# Altium project Acoustics Single Channel.PrjPcb
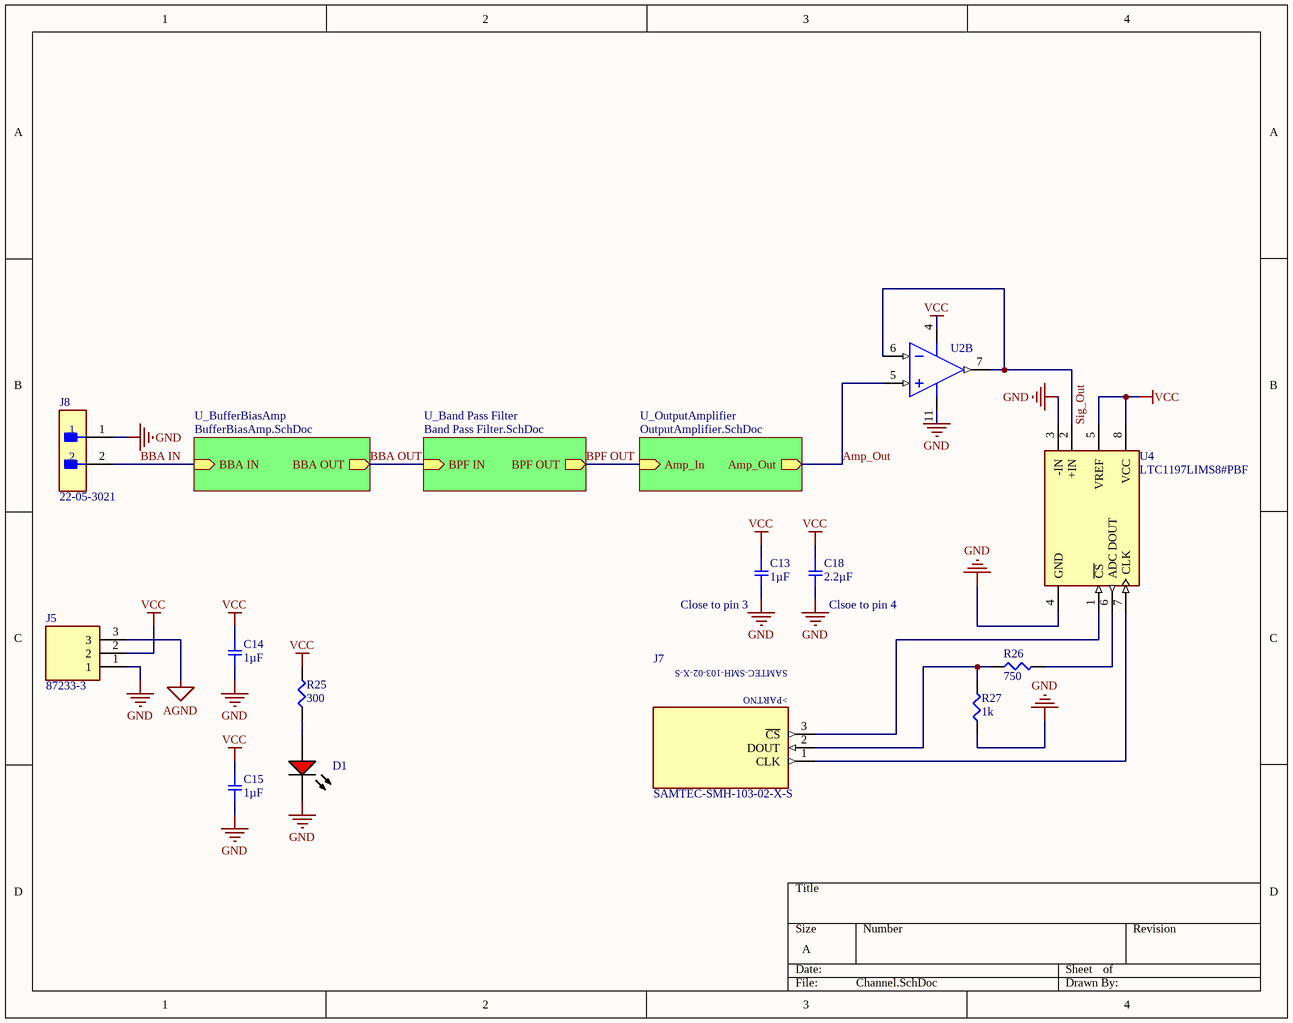
[diagram p0: Channel.SchDoc]
4 sheets, 53 parts. Net scope: hierarchical (ports join the sheet entries above them; power ports are global).
Board file: AcousticsSingleChannel.PcbDoc
Sheets:
  Channel.SchDoc
    U_OutputAmplifier = OutputAmplifier.SchDoc
    U_Band Pass Filter = Band Pass Filter.SchDoc
    U_BufferBiasAmp = BufferBiasAmp.SchDoc

## Sheet Channel.SchDoc
size A; SheetNumber: 1; SheetTotal: 4

### Parts
C13  1µF  [SMD-0603C]
C14  1µF  [SMD-0603C]
C15  1µF  [SMD-0603C]
C18  2.2µF  [SMD-0603C]
D1  TLMS1100-GS08  [VISH-TLMX1100_V]  (value not drawn)
J5  87233-3  [TE_87233-3]
J7  SAMTEC-SMH-103-02-X-S  [SAMTEC-SMH-103-02-X-S]
J8  22-05-3021  [FP-22-05-3021-MFG]
R25  300  [SMD-0603-RES]
R26  750  [SMD-0603-RES]
R27  1k  [SMD-0603-RES]
U2  OPA1604AIPWR  [PW0014A_N]  (value not drawn)  (part B of 4)
U4  LTC1197LIMS8#PBF  [FP-MS8-8-05-08-1660-IPC_A]

### Sub-sheets
U_Band Pass Filter = Band Pass Filter.SchDoc: BPF IN (in), BPF OUT (out)
U_BufferBiasAmp = BufferBiasAmp.SchDoc: BBA IN (in), BBA OUT (out)
U_OutputAmplifier = OutputAmplifier.SchDoc: Amp_In (in), Amp_Out (out)

### Nets
AGND: J5.3
GND: C13.2 C14.1 C15.1 C18.2 D1.2(K) J5.1 J8.1 R27.1 U2.11(V-) U4.3(-IN) U4.4(GND)
VCC: C13.1 C14.2 C15.2 C18.1 J5.2 R25.2 U2.4(V+) U4.5(VREF) U4.8(VCC)
Amp_Out: U2.5(IN_B+) ; sheet U_OutputAmplifier/Amp_Out
BBA IN: J8.2 ; sheet U_BufferBiasAmp/BBA IN
BBA OUT: sheet U_Band Pass Filter/BPF IN, sheet U_BufferBiasAmp/BBA OUT
BPF OUT: sheet U_OutputAmplifier/Amp_In, sheet U_Band Pass Filter/BPF OUT
Sig_Out: U2.6(IN_B-) U2.7(OUT_B) U4.2(+IN)
NetD1_1: D1.1(A) R25.1
NetJ7_1: J7.1(CLK) U4.7(CLK)
NetJ7_2: J7.2(DOUT) R26.1 R27.2
NetJ7_3: J7.3(~{CS}) U4.1(~{CS})
NetR26_2: R26.2 U4.6(ADC_DOUT)

### Notes on the sheet
- (near C13) Close to pin 3
- (near C18) Clsoe to pin 4
- (in symbol SAMTEC-SMH-103-02-X-S) >PARTNO

### Library data of the parts
C13 = GRM185C80J105KE26D: CAP CER 1UF 6.3V X6S 0603; Manufacturer: Murata Electronics North America; Factory Stock: 0; Unit Price (USD): 0.2; Minimum Quantity: 1; Tolerance: ±10%; Datasheets: http://www.murata.com/~/media/webrenewal/support/library/catalog/products/capacitor/mlcc/c02e.pdf; Image: //media.digikey.com/Renders/Murata%20Renders/ZRB-SERIES-0402.jpg; Digi-Key Part Number: 490-8271-1-ND; Part Number: GRM185C80J105KE26D; Quantity Available: 11240; @ qty: 0; Packaging: Cut Tape (CT); Series: GRM; Part Status: Active; Value: 1µF; Voltage: 6.3V; Temperature Coefficient: X6S; Operating Temperature: -55°C ~ 105°C; Features: -; Ratings: -; Applications: General Purpose; Mounting Type: Surface Mount, MLCC; Package / Case: 0603 (1608 Metric); Size / Dimension: 0.063" L x 0.031" W (1.60mm x 0.80mm); Height - Seated (Max): -; Thickness (Max): 0.020" (0.50mm); Lead Spacing: -; Lead Style: -
C14 C15 = GCM188R71C105KA64D: CAP CER 1UF 16V X7R 0603; Manufacturer: Samsung Electro-Mechanics; Manufacturer Part Number: CL10A105KA8NNNC; Value: 1µF; Operating Temperature: -55°C ~ 125°C; Package / Case: 0603 (1608 Metric); Datasheet Link: https://www.digikey.com/en/products/detail/samsung-electro-mechanics/CL10A105KA8NNNC/3886760
C18 = GCM188R70J225KE22D: CAP CER 2.2UF 6.3V X7R 0603; Manufacturer: Murata Electronics North America; Factory Stock: 0; Unit Price (USD): 0.23; Minimum Quantity: 1; Tolerance: ±10%; Datasheets: http://www.murata.com/~/media/webrenewal/support/library/catalog/products/capacitor/mlcc/c03e.ashx; Image: //media.digikey.com/Renders/Murata%20Renders/0603%28GCM188%29.jpg; Digi-Key Part Number: 490-5316-1-ND; Part Number: GCM188R70J225KE22D; Quantity Available: 20695; @ qty: 0; Packaging: Cut Tape (CT); Series: GCM; Part Status: Active; Value: 2.2µF; Voltage: 6.3V; Temperature Coefficient: X7R; Operating Temperature: -55°C ~ 125°C; Features: -; Ratings: AEC-Q200; Applications: Automotive; Mounting Type: Surface Mount, MLCC; Package / Case: 0603 (1608 Metric); Size / Dimension: 0.063" L x 0.031" W (1.60mm x 0.80mm); Height - Seated (Max): -; Thickness (Max): 0.035" (0.90mm); Lead Spacing: -; Lead Style: -
D1 = CMP-1666-00027-1: LED, RED, 2.1 V, -40 to 100 degC, 2-Pin SMD (0603), RoHS, Tape and Reel; Manufacturer: Wurth Elektronics; Manufacturer Part Number: 150080SS75000; Value: 1.9V; Datasheet Link: https://www.mouser.com/ProductDetail/Wurth-Elektronik/150080SS75000?qs=LlUlMxKIyB2zzpiaOzrUdw%3D%3D&mgh=1&gclid=Cj0KCQjwm6KUBhC3ARIsACIwxBhChbj4MsdASq_HKZ9IIHp_SBsI6cWeNQVHWnPWPX4ZaUjtoXFUdFUaAm30EALw_wcB; Operating Temperature: -40to85degC; Package / Case: 0805 (2012 Metric); RoHS: Pb-Free
J5 = 87233-3: MF: {'manufacturer': u'TE Connectivity'}; Value: *; Price: None; Package: None; Availability: Unavailable; MP: 87233-3
J7 = SAMTEC-SMH-103-02-X-S: MF: {'manufacturer': u'Samtec'}; Value: *; Package: None; MP: SAMTEC-SMH-103-02-X-S; Availability: Unavailable; Price: None
J8 = CMP-04776-000166-1: CONN HEADER R/A 2POS 2.54MM; Glow Wire Compliant: Non-compliant; Max Current Rating: 4A; Number of Positions: 2; Contact Resistance: 10mR; Max Voltage Rating (AC): 250V; Gender: Male; Approvals: UL; Contact Material: Brass; Halogen Free: Low Halogen; Depth: 12.83mm; Color: White; Mount: Through Hole; Housing Color: White; Package Quantity: 3000; Series: KK® 7478; Packaging: Bulk; Length: 5.08mm; Fastening Type: Friction; Contact Plating: Tin; Flammability Rating: UL94 V-0; Housing Material: Nylon; Current Rating: 4A; Max Operating Temperature: 75°C; Height: 6.35mm; Lead Free: Lead Free; Pitch: 2.54mm; Termination: Solder; Min Operating Temperature: 0°C; Voltage Rating: 250V; Radiation Hardening: No; Number of Contacts: 2; Contact Mating Length: 0.264inch; Orientation: Right Angle; Contact Type: Male Pin; Number of Rows: 1; Number of Circuits: 2
R25 = ERJ-3EKF3000V: RES SMD 300 OHM 1% 1/10W 0603; Manufacturer: Panasonic Electronic Components; Value: 300; Operating Temperature: -55°C ~ 155°C; Package / Case: 0603 (1608 Metric); Datasheet Link: https://www.digikey.com/en/products/detail/panasonic-electronic-components/ERJ-3EKF3000V/1746363; Manufacturer Part Number: ERJ-3EKF3000V
R26 = ERJ-3EKF7500V: RES SMD 750 OHM 1% 1/10W 0603; Manufacturer: Panasonic Electronic Components; Factory Stock: 0; Unit Price (USD): 0.00379; @ qty: 1500; Minimum Quantity: 1; Power (Watts): 0.1W, 1/10W; Temperature Coefficient: ±100ppm/°C; Part Number: ERJ-3EKF7500V; Datasheets: http://industrial.panasonic.com/www-cgi/jvcr13pz.cgi?E+PZ+3+AOA0002+ERJ3EKF7500V+7+WW; Image: //media.digikey.com/Photos/Panasonic%20Photos/MFG_ERJ-P6W%20Series.jpg; Digi-Key Part Number: P750HCT-ND; Quantity Available: 102837; Packaging: Cut Tape (CT); Series: ERJ; Part Status: Active; Value: 750; Tolerance: ±1%; Composition: Thick Film; Features: Automotive AEC-Q200; Operating Temperature: -55°C ~ 155°C; Package / Case: 0603 (1608 Metric); Supplier Device Package: 0603; Size / Dimension: 0.063" L x 0.031" W (1.60mm x 0.80mm); Height - Seated (Max): 0.022" (0.55mm); Number of Terminations: 2; Failure Rate: -
R27 = ERJ-3EKF1001V: RES SMD 1K OHM 1% 1/10W 0603; Manufacturer: Panasonic Electronic Components; Factory Stock: 0; Unit Price (USD): 0.00379; @ qty: 1500; Minimum Quantity: 1; Power (Watts): 0.1W, 1/10W; Temperature Coefficient: ±100ppm/°C; Part Number: ERJ-3EKF1001V; Datasheets: http://industrial.panasonic.com/www-cgi/jvcr13pz.cgi?E+PZ+3+AOA0002+ERJ3EKF1001V+7+WW; Image: //media.digikey.com/Photos/Panasonic%20Photos/MFG_ERJ-P6W%20Series.jpg; Digi-Key Part Number: P1.00KHCT-ND; Quantity Available: 5218845; Packaging: Cut Tape (CT); Series: ERJ; Part Status: Active; Value: 1k; Tolerance: ±1%; Composition: Thick Film; Features: Automotive AEC-Q200; Operating Temperature: -55°C ~ 155°C; Package / Case: 0603 (1608 Metric); Supplier Device Package: 0603; Size / Dimension: 0.063" L x 0.031" W (1.60mm x 0.80mm); Height - Seated (Max): 0.022" (0.55mm); Number of Terminations: 2; Failure Rate: -
U2 = CMP-0272-01731-3: Sound Plus High-Performance, Bipolar-Input Audio Operational Amplifier, 4.5 to 36 V, -40 to 85 degC, 14-pin SOP (PW14), Green (RoHS & no Sb/Br); Manufacturer: Texas Instruments; Datasheet Link: https://www.digikey.com/en/products/detail/texas-instruments/OPA1604AIPWR/2793768; Manufacturer Part Number: OPA1604AIPWR; Operating Temperature: -40°C ~ 85°C; Package / Case: 14-TSSOP
U4 = CMP-09081-000582-1: IC ADC 10BIT SAR 8MSOP; Number of Converters: 1; Polarity: Unipolar; Max Supply Voltage: 4V; Number of Bits: 10; Max Power Dissipation: 25mW; Min Supply Voltage: 2.7V; Sampling Rate: 250000S/s; Integral Nonlinearity (INL): 1LSB; Supply Type: Single; Resolution: 10b; Power Dissipation: 500mW; Interface: SPI; Operating Supply Voltage: 3V; Package Quantity: 50; Min Operating Temperature: -40°C; Case/Package: MSOP; Lead Free: Lead Free; Max Operating Temperature: 85°C; Number of Elements: 1; RoHS Compliant: Yes; Mount: Surface Mount; Number of Pins: 8; Packaging: Rail/Tube

## Sheet OutputAmplifier.SchDoc
size A; SheetNumber: 4; SheetTotal: 4
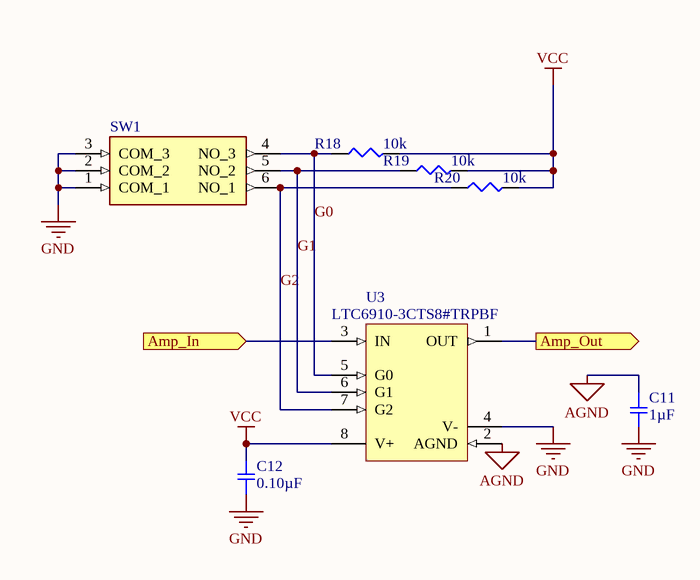
[diagram p1: OutputAmplifier.SchDoc]

### Parts
C11  1µF  [SMD-0603C]
C12  0.10µF  [SMD-0603C]
R18  10k  [SMD-0603-RES]
R19  10k  [SMD-0603-RES]
R20  10k  [SMD-0603-RES]
SW1  416131160803  [416131160803]  (value not drawn)
U3  LTC6910-3CTS8#TRPBF  [LT-TS8-8-TSOT-23_V]

### Ports
Amp_In (in), Amp_Out (out)

### Nets
AGND: C11.1 U3.2(AGND)
GND: C11.2 C12.1 SW1.1(COM_1) SW1.2(COM_2) SW1.3(COM_3) U3.4(V-)
VCC: C12.2 R18.2 R19.2 R20.2 U3.8(V+)
Amp_Out: U3.1(OUT) ; port Amp_Out
BPF OUT: U3.3(IN) ; port Amp_In
G0: R18.1 SW1.4(NO_3) U3.5(G0)
G1: R19.1 SW1.5(NO_2) U3.6(G1)
G2: R20.1 SW1.6(NO_1) U3.7(G2)

### Library data of the parts
C11 = GCM188R71C105KA64D: CAP CER 1UF 16V X7R 0603; Manufacturer: Murata Electronics North America; Factory Stock: 0; Unit Price (USD): 0.24; Minimum Quantity: 1; Tolerance: ±10%; Datasheets: http://www.murata.com/~/media/webrenewal/support/library/catalog/products/capacitor/mlcc/c03e.ashx; Image: //media.digikey.com/Renders/Murata%20Renders/0603%28GCM188%29.jpg; Digi-Key Part Number: 490-5241-1-ND; Part Number: GCM188R71C105KA64D; Quantity Available: 9243; @ qty: 0; Packaging: Cut Tape (CT); Series: GCM; Part Status: Active; Value: 1µF; Voltage: 16V; Temperature Coefficient: X7R; Operating Temperature: -55°C ~ 125°C; Features: -; Ratings: AEC-Q200; Applications: Automotive; Mounting Type: Surface Mount, MLCC; Package / Case: 0603 (1608 Metric); Size / Dimension: 0.063" L x 0.031" W (1.60mm x 0.80mm); Height - Seated (Max): -; Thickness (Max): 0.035" (0.90mm); Lead Spacing: -; Lead Style: -
C12 = GCJ188R71C104KA01D: CAP CER 0.1UF 16V X7R 0603; Manufacturer: Murata Electronics North America; Factory Stock: 0; Unit Price (USD): 0.21; Minimum Quantity: 1; Tolerance: ±10%; Datasheets: http://www.murata.com/~/media/webrenewal/support/library/catalog/products/capacitor/mlcc/c03e.ashx; Image: //media.digikey.com/Renders/Murata%20Renders/0603%28LQG18%29.jpg; Digi-Key Part Number: 490-5796-1-ND; Part Number: GCJ188R71C104KA01D; Quantity Available: 22473; @ qty: 0; Packaging: Cut Tape (CT); Series: GCJ; Part Status: Active; Value: 0.10µF; Voltage: 16V; Temperature Coefficient: X7R; Operating Temperature: -55°C ~ 125°C; Features: Soft Termination; Ratings: AEC-Q200; Applications: Automotive, Boardflex Sensitive; Mounting Type: Surface Mount, MLCC; Package / Case: 0603 (1608 Metric); Size / Dimension: 0.063" L x 0.031" W (1.60mm x 0.80mm); Height - Seated (Max): -; Thickness (Max): 0.035" (0.90mm); Lead Spacing: -; Lead Style: -
R18-R20 = ERJ-3EKF1002V: RES SMD 10K OHM 1% 1/10W 0603; Manufacturer: Panasonic Electronic Components; Manufacturer Part Number: RNCP0603FTD10K0; Value: 10k; Operating Temperature: -55°C ~ 155°C; Package / Case: 0603 (1608 Metric); Datasheet Link: https://www.digikey.com/en/products/detail/stackpole-electronics-inc/RNCP0603FTD10K0/2240139
SW1 = 416131160803: Switch; Manufacturer_Name: Wurth Elektronik; Datasheet Link: https://www.we-online.com/catalog/datasheet/416131160803.pdf; Height: 2.65mm; Manufacturer_Part_Number: 416131160803; Mouser Part Number: 710-416131160803; Mouser Price/Stock: https://www.mouser.co.uk/ProductDetail/Wurth-Elektronik/416131160803?qs=2kOmHSv6VfS5Uv9iBh18ZA%3D%3D
U3 = CMP-0359-03721-2: Manufacturer: Analog Devices Inc.; Manufacturer Part Number: LTC6910-3CTS8#TRMPBF; RoHS: Pb-Free; Value: N/A; Operating Temperature: 0°C ~ 70°C; Datasheet Link: https://www.analog.com/media/en/technical-documentation/data-sheets/6910fb.pdf; Package / Case: TSOT-23-8

## Sheet Band Pass Filter.SchDoc
size 431 x 279 mm; Organization: ORGANIZATION; Address1: ADDRESS 1; Address2: ADDRESS 2; Address3: ADDRESS 3; Address4: ADDRESS 4; Revision: -; SheetNumber: 2; SheetTotal: 4; ENG_APP_DATE: --/--/--; DSN_APP_DATE: --/--/--; CHK_APP_DATE: --/--/--
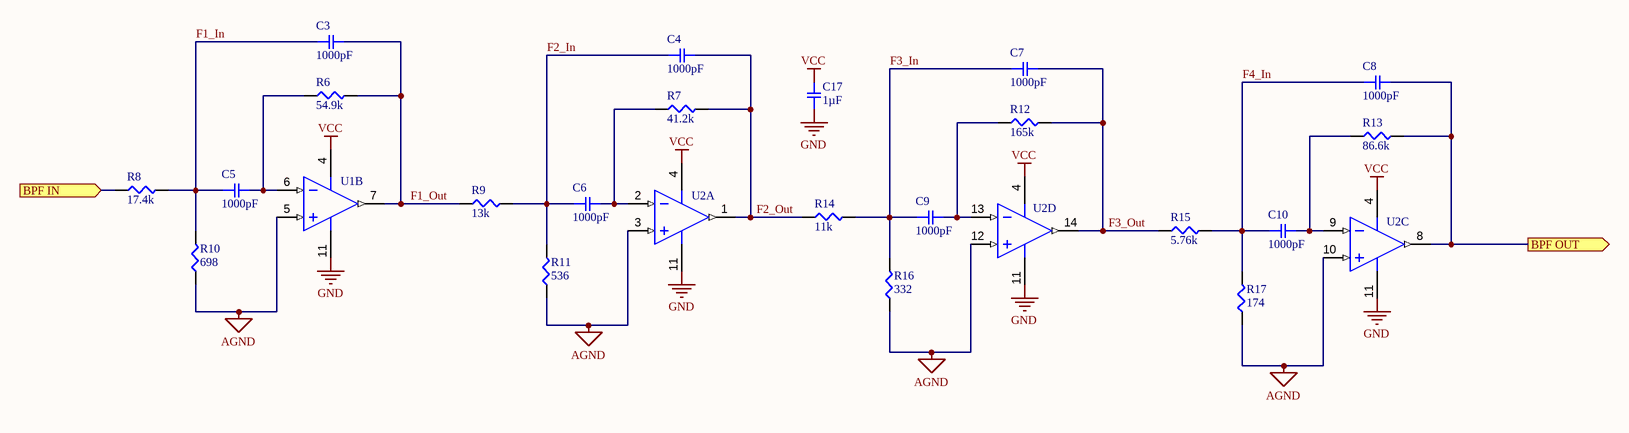
[diagram p2: Band Pass Filter.SchDoc]

### Parts
C3  1000pF  [SMD-0603C]
C4  1000pF  [SMD-0603C]
C5  1000pF  [SMD-0603C]
C6  1000pF  [SMD-0603C]
C7  1000pF  [SMD-0603C]
C8  1000pF  [SMD-0603C]
C9  1000pF  [SMD-0603C]
C10  1000pF  [SMD-0603C]
C17  1µF  [SMD-0603C]
R6  54.9k  [SMD-0603-RES]
R7  41.2k  [SMD-0603-RES]
R8  17.4k  [SMD-0603-RES]
R9  13k  [SMD-0603-RES]
R10  698  [SMD-0603-RES]
R11  536  [SMD-0603-RES]
R12  165k  [SMD-0603-RES]
R13  86.6k  [SMD-0603-RES]
R14  11k  [SMD-0603-RES]
R15  5.76k  [SMD-0603-RES]
R16  332  [SMD-0603-RES]
R17  174  [SMD-0603-RES]
U1  OPA1604AIPWR  [PW0014A_N]  (value not drawn)  (part B of 4)
U2  OPA1604AIPWR  [PW0014A_N]  (value not drawn)  (parts A,C,D of 4)

### Ports
BPF IN (in), BPF OUT (out)

### Nets
AGND: R10.1 R11.1 R16.1 R17.1 U1.5(IN_B+) U2.3(IN_A+) U2.10(IN_C+) U2.12(IN_D+)
GND: C17.1 U1.11(V-) U2.11(V-)
VCC: C17.2 U1.4(V+) U2.4(V+)
BBA OUT: R8.1 ; port BPF IN
BPF OUT: C8.2 R13.2 U2.8(OUT_C) ; port BPF OUT
F1_In: C3.1 C5.1 R8.2 R10.2
F1_Out: C3.2 R6.2 R9.1 U1.7(OUT_B)
F2_In: C4.1 C6.1 R9.2 R11.2
F2_Out: C4.2 R7.2 R14.1 U2.1(OUT_A)
F3_In: C7.1 C9.1 R14.2 R16.2
F3_Out: C7.2 R12.2 R15.1 U2.14(OUT_D)
F4_In: C8.1 C10.1 R15.2 R17.2
NetC5_2: C5.2 R6.1 U1.6(IN_B-)
NetC6_2: C6.2 R7.1 U2.2(IN_A-)
NetC9_2: C9.2 R12.1 U2.13(IN_D-)
NetC10_2: C10.2 R13.1 U2.9(IN_C-)

### Notes on the sheet
- DWG. NO.
- REV.
- SHT.
- THIS DOCUMENT AND THE DATA DISCLOSED HEREIN OR HEREWITH IS THE PROPERTY OF ALTIUM LIMITED AND MAY BE FREELY DISTRIBUTED IN WHOLE. NO RIGHTS ARE RESERVED OR EXPRESS OR IMPLIED WARANTEE GIVEN.
- REVISION
- DESCRIPTION
- DATE
- APPROVED
- ENG:
- APPROVALS
- PROJECT
- DSN:
- CHK:
- REFERENCE DOCUMENTS
- PROJECT REVISION:
- TITLE
- DOCUMENT REVISION:
- DESIGN ITEM:
- BOM:
- FAB DWG:
- PCB DWG:
- ASSY DWG:
- SCALE:
- SIZE
- B
- CAGE CODE
- FILE NAME
- DWG NO.
- SHEET
- OF
- REV

### Library data of the parts
C3-C10 = GCJ188R71H102KA01D: CAP CER 1000PF 50V X7R 0603; Manufacturer: Walsin Technology Corporation; Manufacturer Part Number: 0603N102F500CT; Value: 1000pF; Operating Temperature: -55°C ~ 125°C; Package / Case: 0603 (1608 Metric); Datasheet Link: https://www.digikey.com/en/products/detail/walsin-technology-corporation/0603N102F500CT/9354972
C17 = GCM188R71C105KA64D: as C14 on sheet Channel; Value: 1µF; Operating Temperature: -55°C ~ 125°C; Package / Case: 0603 (1608 Metric); Datasheet Link: https://www.digikey.com/en/products/detail/samsung-electro-mechanics/CL10A105KA8NNNC/3886760
R6 = ERJ-3EKF5492V: RES SMD 54.9K OHM 1% 1/10W 0603; Manufacturer: Panasonic Electronic Components; Value: 54.9k; Operating Temperature: -55°C ~ 155°C; Package / Case: 0603 (1608 Metric); Datasheet Link: https://www.digikey.com/en/products/detail/panasonic-electronic-components/ERJ-3EKF5492V/196403; Manufacturer Part Number: ERJ-3EKF5492V
R7 = ERJ-3EKF4122V: RES SMD 41.2K OHM 1% 1/10W 0603; Manufacturer: Panasonic Electronic Components; Value: 41.2k; Operating Temperature: -55°C ~ 155°C; Package / Case: 0603 (1608 Metric); Datasheet Link: https://www.digikey.com/en/products/detail/yageo/RC0603FR-0741K2L/727225; Manufacturer Part Number: ERJ-3EKF4122V
R8 = ERJ-3EKF1742V: RES SMD 17.4K OHM 1% 1/10W 0603; Manufacturer: Panasonic Electronic Components; Value: 17.4k; Operating Temperature: -55°C ~ 155°C; Package / Case: 0603 (1608 Metric); Datasheet Link: https://www.digikey.com/en/products/detail/panasonic-electronic-components/ERJ-3EKF1742V/196159; Manufacturer Part Number: ERJ-3EKF1742V
R9 = ERJ-3EKF1302V: RES SMD 13K OHM 1% 1/10W 0603; Manufacturer: Panasonic Electronic Components; Value: 13k; Operating Temperature: -55°C ~ 155°C; Package / Case: 0603 (1608 Metric); Datasheet Link: https://www.digikey.com/en/products/detail/panasonic-electronic-components/ERJ-3EKF1302V/196110; Manufacturer Part Number: ERJ-3EKF1302V
R10 = ERJ-3EKF6980V: RES SMD 698 OHM 1% 1/10W 0603; Manufacturer: Panasonic Electronic Components; Value: 698; Operating Temperature: -55°C ~ 155°C; Package / Case: 0603 (1608 Metric); Datasheet Link: https://www.digikey.com/en/products/detail/panasonic-electronic-components/ERJ-3EKF6980V/196453; Manufacturer Part Number: ERJ-3EKF6980V
R11 = ERJ-3EKF5360V: RES SMD 536 OHM 1% 1/10W 0603; Manufacturer: Panasonic Electronic Components; Value: 536; Operating Temperature: -55°C ~ 155°C; Package / Case: 0603 (1608 Metric); Datasheet Link: https://www.digikey.com/en/products/detail/panasonic-electronic-components/ERJ-3EKF5360V/196400; Manufacturer Part Number: ERJ-3EKF5360V
R12 = ERJ-3EKF1653V: RES SMD 165K OHM 1% 1/10W 0603; Manufacturer: Panasonic Electronic Components; Value: 165k; Operating Temperature: -55°C ~ 155°C; Package / Case: 0603 (1608 Metric); Datasheet Link: https://www.digikey.com/en/products/detail/panasonic-electronic-components/ERJ-3EKF1653V/196155; Manufacturer Part Number: ERJ-3EKF1653V
R13 = ERJ-3EKF8662V: RES SMD 86.6K OHM 1% 1/10W 0603; Manufacturer: Panasonic Electronic Components; Value: 86.6k; Operating Temperature: -55°C ~ 155°C; Package / Case: 0603 (1608 Metric); Datasheet Link: https://www.digikey.com/en/products/detail/panasonic-electronic-components/ERJ-3EKF8662V/196500; Manufacturer Part Number: ERJ-3EKF8662V
R14 = ERJ-3EKF1102V: RES SMD 11K OHM 1% 1/10W 0603; Manufacturer: Panasonic Electronic Components; Value: 11k; Operating Temperature: -55°C ~ 155°C; Package / Case: 0603 (1608 Metric); Datasheet Link: https://www.digikey.com/en/products/detail/panasonic-electronic-components/ERJ-3EKF1102V/196083; Manufacturer Part Number: ERJ-3EKF1102V
R15 = ERJ-3EKF5761V: RES SMD 5.76K OHM 1% 1/10W 0603; Manufacturer: Panasonic Electronic Components; Value: 5.76k; Operating Temperature: -55°C ~ 155°C; Package / Case: 0603 (1608 Metric); Datasheet Link: https://www.digikey.com/en/products/detail/panasonic-electronic-components/ERJ-3EKF5761V/196388; Manufacturer Part Number: ERJ-3EKF5761V
R16 = ERJ-3EKF3320V: RES SMD 332 OHM 1% 1/10W 0603; Manufacturer: Panasonic Electronic Components; Value: 332; Operating Temperature: -55°C ~ 155°C; Package / Case: 0603 (1608 Metric); Datasheet Link: https://www.digikey.com/en/products/detail/panasonic-electronic-components/ERJ-3EKF3320V/196300; Manufacturer Part Number: ERJ-3EKF3320V
R17 = ERJ-3EKF1740V: RES SMD 174 OHM 1% 1/10W 0603; Manufacturer: Panasonic Electronic Components; Value: 174; Operating Temperature: -55°C ~ 155°C; Package / Case: 0603 (1608 Metric); Datasheet Link: https://www.digikey.com/en/products/detail/panasonic-electronic-components/ERJ-3EKF1740V/196162; Manufacturer Part Number: ERJ-3EKF1740V
U1 U2 = CMP-0272-01731-3: as U2 on sheet Channel; Datasheet Link: https://www.digikey.com/en/products/detail/texas-instruments/OPA1604AIPWR/2793768; Manufacturer Part Number: OPA1604AIPWR; Operating Temperature: -40°C ~ 85°C; Package / Case: 14-TSSOP

## Sheet BufferBiasAmp.SchDoc
size A; SheetNumber: 3; SheetTotal: 4
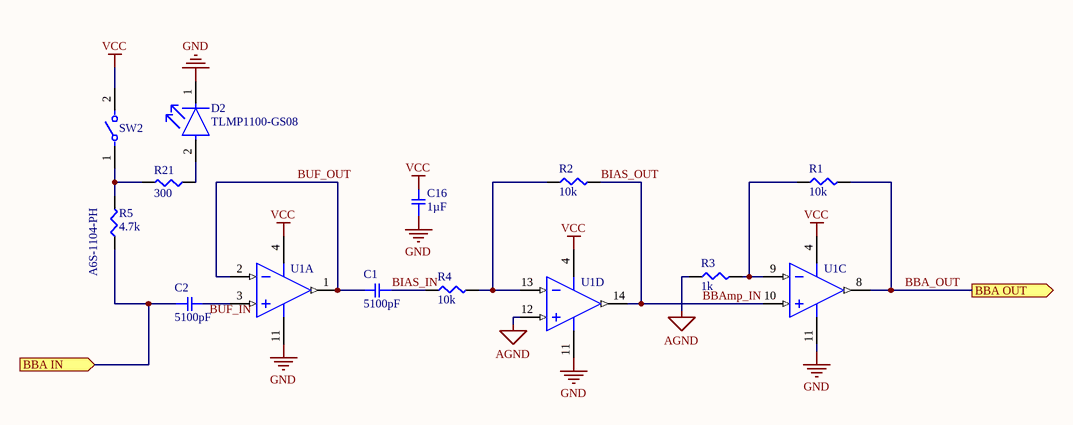
[diagram p3: BufferBiasAmp.SchDoc]

### Parts
C1  5100pF  [SMD-0603C]
C2  5100pF  [SMD-0603C]
C16  1µF  [SMD-0603C]
D2  TLMP1100-GS08  [FP-6_541-5056_01-4-MFG]
R1  10k  [SMD-0603-RES]
R2  10k  [SMD-0603-RES]
R3  1k  [SMD-0603-RES]
R4  10k  [SMD-0603-RES]
R5  4.7k  [SMD-0603-RES]
R21  300  [SMD-0603-RES]
SW2  Switch_Omron_A6S-1104-PH_eec  [Omron_A6S-1104-PH_0]  (value not drawn)
U1  OPA1604AIPWR  [PW0014A_N]  (value not drawn)  (parts A,C,D of 4)

### Ports
BBA IN (in), BBA OUT (out)

### Nets
AGND: R3.1 U1.12(IN_D+)
GND: C16.1 D2.1(C) U1.11(V-)
VCC: C16.2 SW2.2 U1.4(V+)
BBA IN: C2.1 R5.1 ; port BBA IN
BBA_OUT: R1.2 U1.8(OUT_C) ; port BBA OUT  [project net BBA OUT]
BBAmp_IN: R2.2 U1.10(IN_C+) U1.14(OUT_D)  [also labelled BIAS_OUT]
BIAS_IN: C1.1 R4.1
BUF_OUT: C1.2 U1.1(OUT_A) U1.2(IN_A-)
NetC2_2: C2.2 U1.3(IN_A+)
NetD2_2: D2.2(A) R21.1
NetR1_1: R1.1 R3.2 U1.9(IN_C-)
NetR2_1: R2.1 R4.2 U1.13(IN_D-)
NetR5_2: R5.2 R21.2 SW2.1

### Notes on the sheet
- (near R5) A6S-1104-PH
- Labels drawn without touching a wire or pin: BUF_IN

### Library data of the parts
C1 = GRM1887U1H512JA01D: CAP CER 5100PF 50V U2J 0603; Manufacturer: Murata Electronics North America; Value: 5100pF; Operating Temperature: -55°C ~ 125°C; Package / Case: 0603 (1608 Metric); Datasheet Link: https://www.digikey.com/en/products/detail/murata-electronics/GRM1887U1H512JA01D/2612102; Manufacturer Part Number: GRM1887U1H512JA01D
C2 = GRM1887U1H512JA01D: CAP CER 5100PF 50V U2J 0603; Manufacturer: Murata Electronics North America; Factory Stock: 0; Unit Price (USD): 0.2; Minimum Quantity: 1; Tolerance: ±5%; Datasheets: http://www.murata.com/~/media/webrenewal/support/library/catalog/products/capacitor/mlcc/c02e.pdf; Image: //media.digikey.com/Renders/Murata%20Renders/ZRB-SERIES-0402.jpg; Digi-Key Part Number: 490-6399-1-ND; Part Number: GRM1887U1H512JA01D; Quantity Available: 12288; @ qty: 0; Packaging: Cut Tape (CT); Series: GRM; Part Status: Active; Value: 5100pF; Voltage: 50V; Temperature Coefficient: U2J; Operating Temperature: -55°C ~ 125°C; Features: -; Ratings: -; Applications: General Purpose; Mounting Type: Surface Mount, MLCC; Package / Case: 0603 (1608 Metric); Size / Dimension: 0.063" L x 0.031" W (1.60mm x 0.80mm); Height - Seated (Max): -; Thickness (Max): 0.035" (0.90mm); Lead Spacing: -; Lead Style: -
C16 = GCM188R71C105KA64D: as C14 on sheet Channel; Value: 1µF; Operating Temperature: -55°C ~ 125°C; Package / Case: 0603 (1608 Metric); Datasheet Link: https://www.digikey.com/en/products/detail/samsung-electro-mechanics/CL10A105KA8NNNC/3886760
D2 = CMP-02520-000009-1: LED GREEN 0603 SMD; Manufacturer: Vishay; Description: Green 561nm LED Indication - Discrete 2.1V 0603 (1608 Metric); Max Junction Temp: +120°C; Automotive Grade: Grade 3; Reverse Voltage: 6V; Led Orientation: Top View; Forward Voltage: 2.1V; Luminous Intensity: 15mcd; Forward Current: 20mA; Colour: Pure green; Peak Emmision Wavelength: 562nm; Wavelength: 561nm; Viewing Angle: 160°; Power Dissipation: 90mW; Digikey Description: LED GREEN 0603 SMD; Package: 6.541-5056.01-4; Ambient Temperature Range High: +100°C; Height: 0.65mm; Device Class L1: Optoelectronics; Device Class L2: LEDs; Mouser Description: Standard LEDs - SMD Pure Green; Temperature Range High: +120°C; RoHS: TRUE; Ambient Temperature Range Low: -40°C; Temperature: to +120°C; Manufacturer Part Number: TLMP1100-GS08; ComponentLink2URL: http://www.vishay.com/docs/83173/tlmb1100.pdf; Lead Free: Yes; Octopart: https://octopart.com/tlmp1100-gs08-vishay-55433993; Automotive: Yes; Device Class L3: unset; ComponentLink2Description: Datasheet; Category: Diode
R1 R2 R4 = ERJ-3EKF1002V: as R18 on sheet OutputAmplifier; Value: 10k; Operating Temperature: -55°C ~ 155°C; Package / Case: 0603 (1608 Metric); Datasheet Link: https://www.digikey.com/en/products/detail/stackpole-electronics-inc/RNCP0603FTD10K0/2240139
R3 = ERJ-3EKF1001V: RES SMD 1K OHM 1% 1/10W 0603; Manufacturer: Stackpole Electronics Inc; Manufacturer Part Number: RNCP0603FTD1K00; Value: 1k; Operating Temperature: -55°C ~ 155°C; Package / Case: 0603 (1608 Metric); Datasheet Link: https://www.digikey.com/en/products/detail/stackpole-electronics-inc/RNCP0603FTD1K00/2240106
R5 = ERJ-3EKF4701V: RES SMD 4.7K OHM 1% 1/10W 0603; Manufacturer: Panasonic Electronic Components; Value: 4.7k; Operating Temperature: -55°C ~ 155°C; Package / Case: 0603 (1608 Metric); Datasheet Link: https://www.digikey.com/en/products/detail/panasonic-electronic-components/ERJ-3EKF4701V/1746419; Manufacturer Part Number: ERJ-3EKF4701V
R21 = ERJ-3EKF3000V: as R25 on sheet Channel; Value: 300; Operating Temperature: -55°C ~ 155°C; Package / Case: 0603 (1608 Metric); Datasheet Link: https://www.digikey.com/en/products/detail/panasonic-electronic-components/ERJ-3EKF3000V/1746363; Manufacturer Part Number: ERJ-3EKF3000V
SW2 = Switch_Omron_A6S-1104-PH_eec: SWITCH SLIDE DIP SPST 25MA 24V; Manufacturer: Omron; Part Number: A6S-1104-PH; helpURL: https://upverter.com/upn/revision/12a774d2564c312a/; ComponentLink2Description: Datasheet; Temperature: -20°C to +70°C; Package: SMT_SW; Supplier 2: Mouser; Price: 1.25010001648; Supplier 1: Digi-Key; ComponentLink1URL: https://upverter.com/upn/revision/12a774d2564c312a/; Supplier Part Number 2: 653-A6S1104PH; Supplier Part Number 1: A6S-1104-PH-ND; Voltage: 24V; ComponentLink1Description: Upverter; ComponentLink2URL: http://www.omron.com/ecb/products/pdf/en-a6s.pdf; RoHS: TRUE; Mouser Part Number: 653-A6S1104PH; Temperature Range High: +70°C; Digikey Description: SWITCH SLIDE DIP SPST 25MA 24V; Digikey Part Number: A6S-1104-PH-ND; Lead Free: yes; Temperature Range Low: -20°C
U1 = CMP-0272-01731-3: as U2 on sheet Channel; Datasheet Link: https://www.digikey.com/en/products/detail/texas-instruments/OPA1604AIPWR/2793768; Manufacturer Part Number: OPA1604AIPWR; Operating Temperature: -40°C ~ 85°C; Package / Case: 14-TSSOP

## Nets that join several sheets
AGND: Channel (J5.3), OutputAmplifier (C11.1 U3.2), Band Pass Filter (8 pins), BufferBiasAmp (R3.1 U1.12)
GND: Channel (11 pins), OutputAmplifier (6 pins), Band Pass Filter (C17.1 U1.11 U2.11), BufferBiasAmp (C16.1 D2.1 U1.11)
VCC: Channel (9 pins), OutputAmplifier (5 pins), Band Pass Filter (C17.2 U1.4 U2.4), BufferBiasAmp (C16.2 SW2.2 U1.4)
Amp_Out: Channel (U2.5), OutputAmplifier (U3.1)
BBA IN: Channel (J8.2), BufferBiasAmp (C2.1 R5.1)
BBA OUT: Band Pass Filter (R8.1), BufferBiasAmp (R1.2 U1.8)
BPF OUT: OutputAmplifier (U3.3), Band Pass Filter (C8.2 R13.2 U2.8)